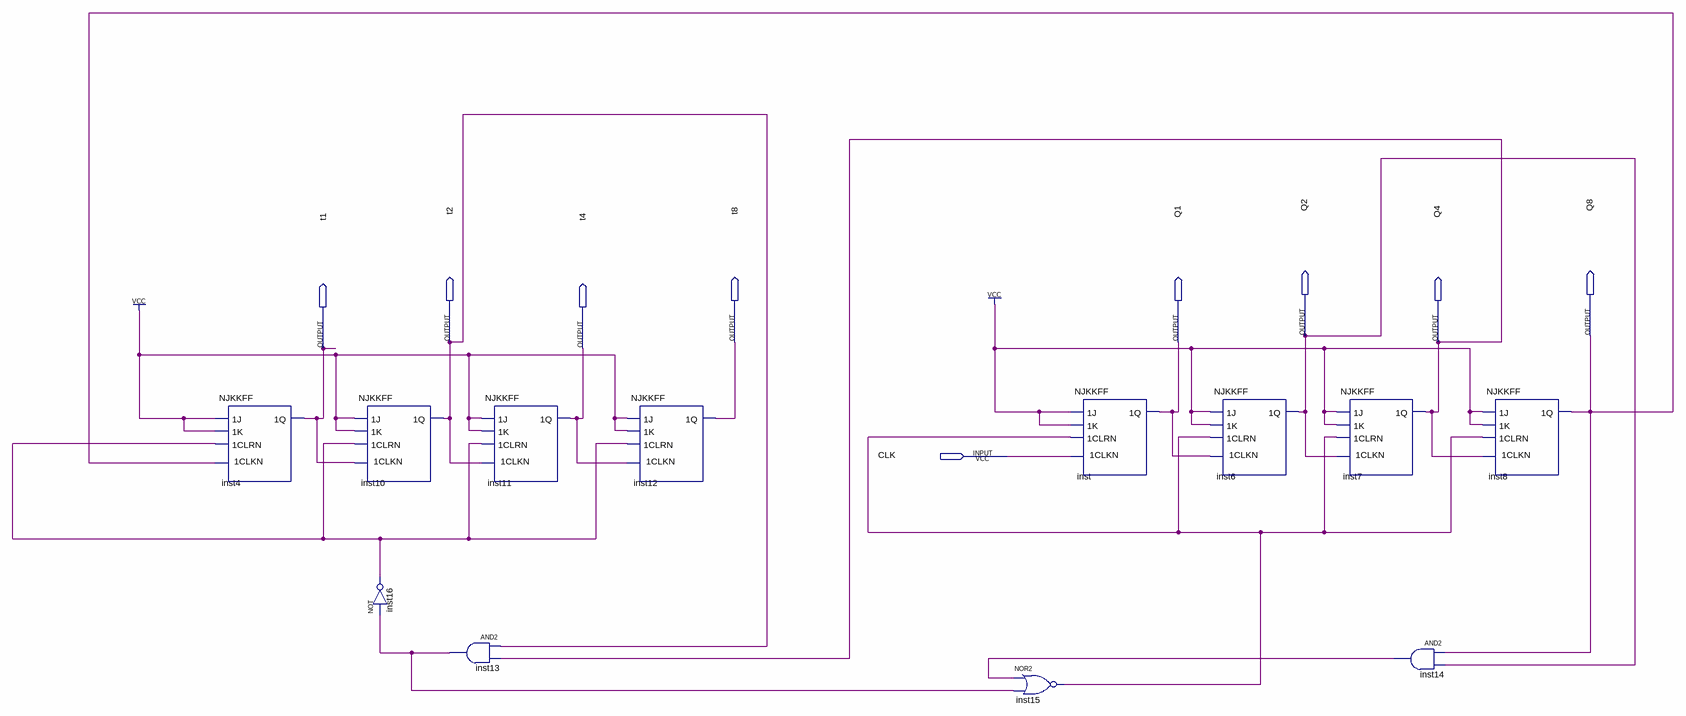
[diagram p0: schematic sheet]
// Quartus schematic mod24.bdf as structural Verilog: 12 symbols, 9 pins
module mod24 (
  input  CLK,
  output Q2,
  output Q8,
  output t2,
  output t8,
  output Q1,
  output Q4,
  output t1,
  output t4
);

  wire inst13_out, inst14_out, inst15_out, inst16_out;

  NJKKFF inst4 (.\1J (1'b1), .\1K (1'b1), .\1CLKN (Q8), .\1CLRN (inst16_out), .\1Q (t1));
  NJKKFF inst10 (.\1J (1'b1), .\1K (1'b1), .\1CLKN (t1), .\1CLRN (inst16_out), .\1Q (t2));
  not inst16 (inst16_out, inst13_out);
  and inst13 (inst13_out, t2, Q4);
  NJKKFF inst11 (.\1J (1'b1), .\1K (1'b1), .\1CLKN (t2), .\1CLRN (inst16_out), .\1Q (t4));
  NJKKFF inst12 (.\1J (1'b1), .\1K (1'b1), .\1CLKN (t4), .\1CLRN (inst16_out), .\1Q (t8));
  nor inst15 (inst15_out, inst14_out, inst13_out);
  NJKKFF inst (.\1J (1'b1), .\1K (1'b1), .\1CLKN (CLK), .\1CLRN (inst15_out), .\1Q (Q1));
  NJKKFF inst6 (.\1J (1'b1), .\1K (1'b1), .\1CLKN (Q1), .\1CLRN (inst15_out), .\1Q (Q2));
  NJKKFF inst7 (.\1J (1'b1), .\1K (1'b1), .\1CLKN (Q2), .\1CLRN (inst15_out), .\1Q (Q4));
  and inst14 (inst14_out, Q8, Q2);
  NJKKFF inst8 (.\1J (1'b1), .\1K (1'b1), .\1CLKN (Q4), .\1CLRN (inst15_out), .\1Q (Q8));
endmodule
